# EasyEDA schematic Water_Counter_Nathan_Amir.json
TITLE: Counter_Water; REV: 1.0; Date: 2025-07-06; Sheet: 1/1; Company: Museum of Science
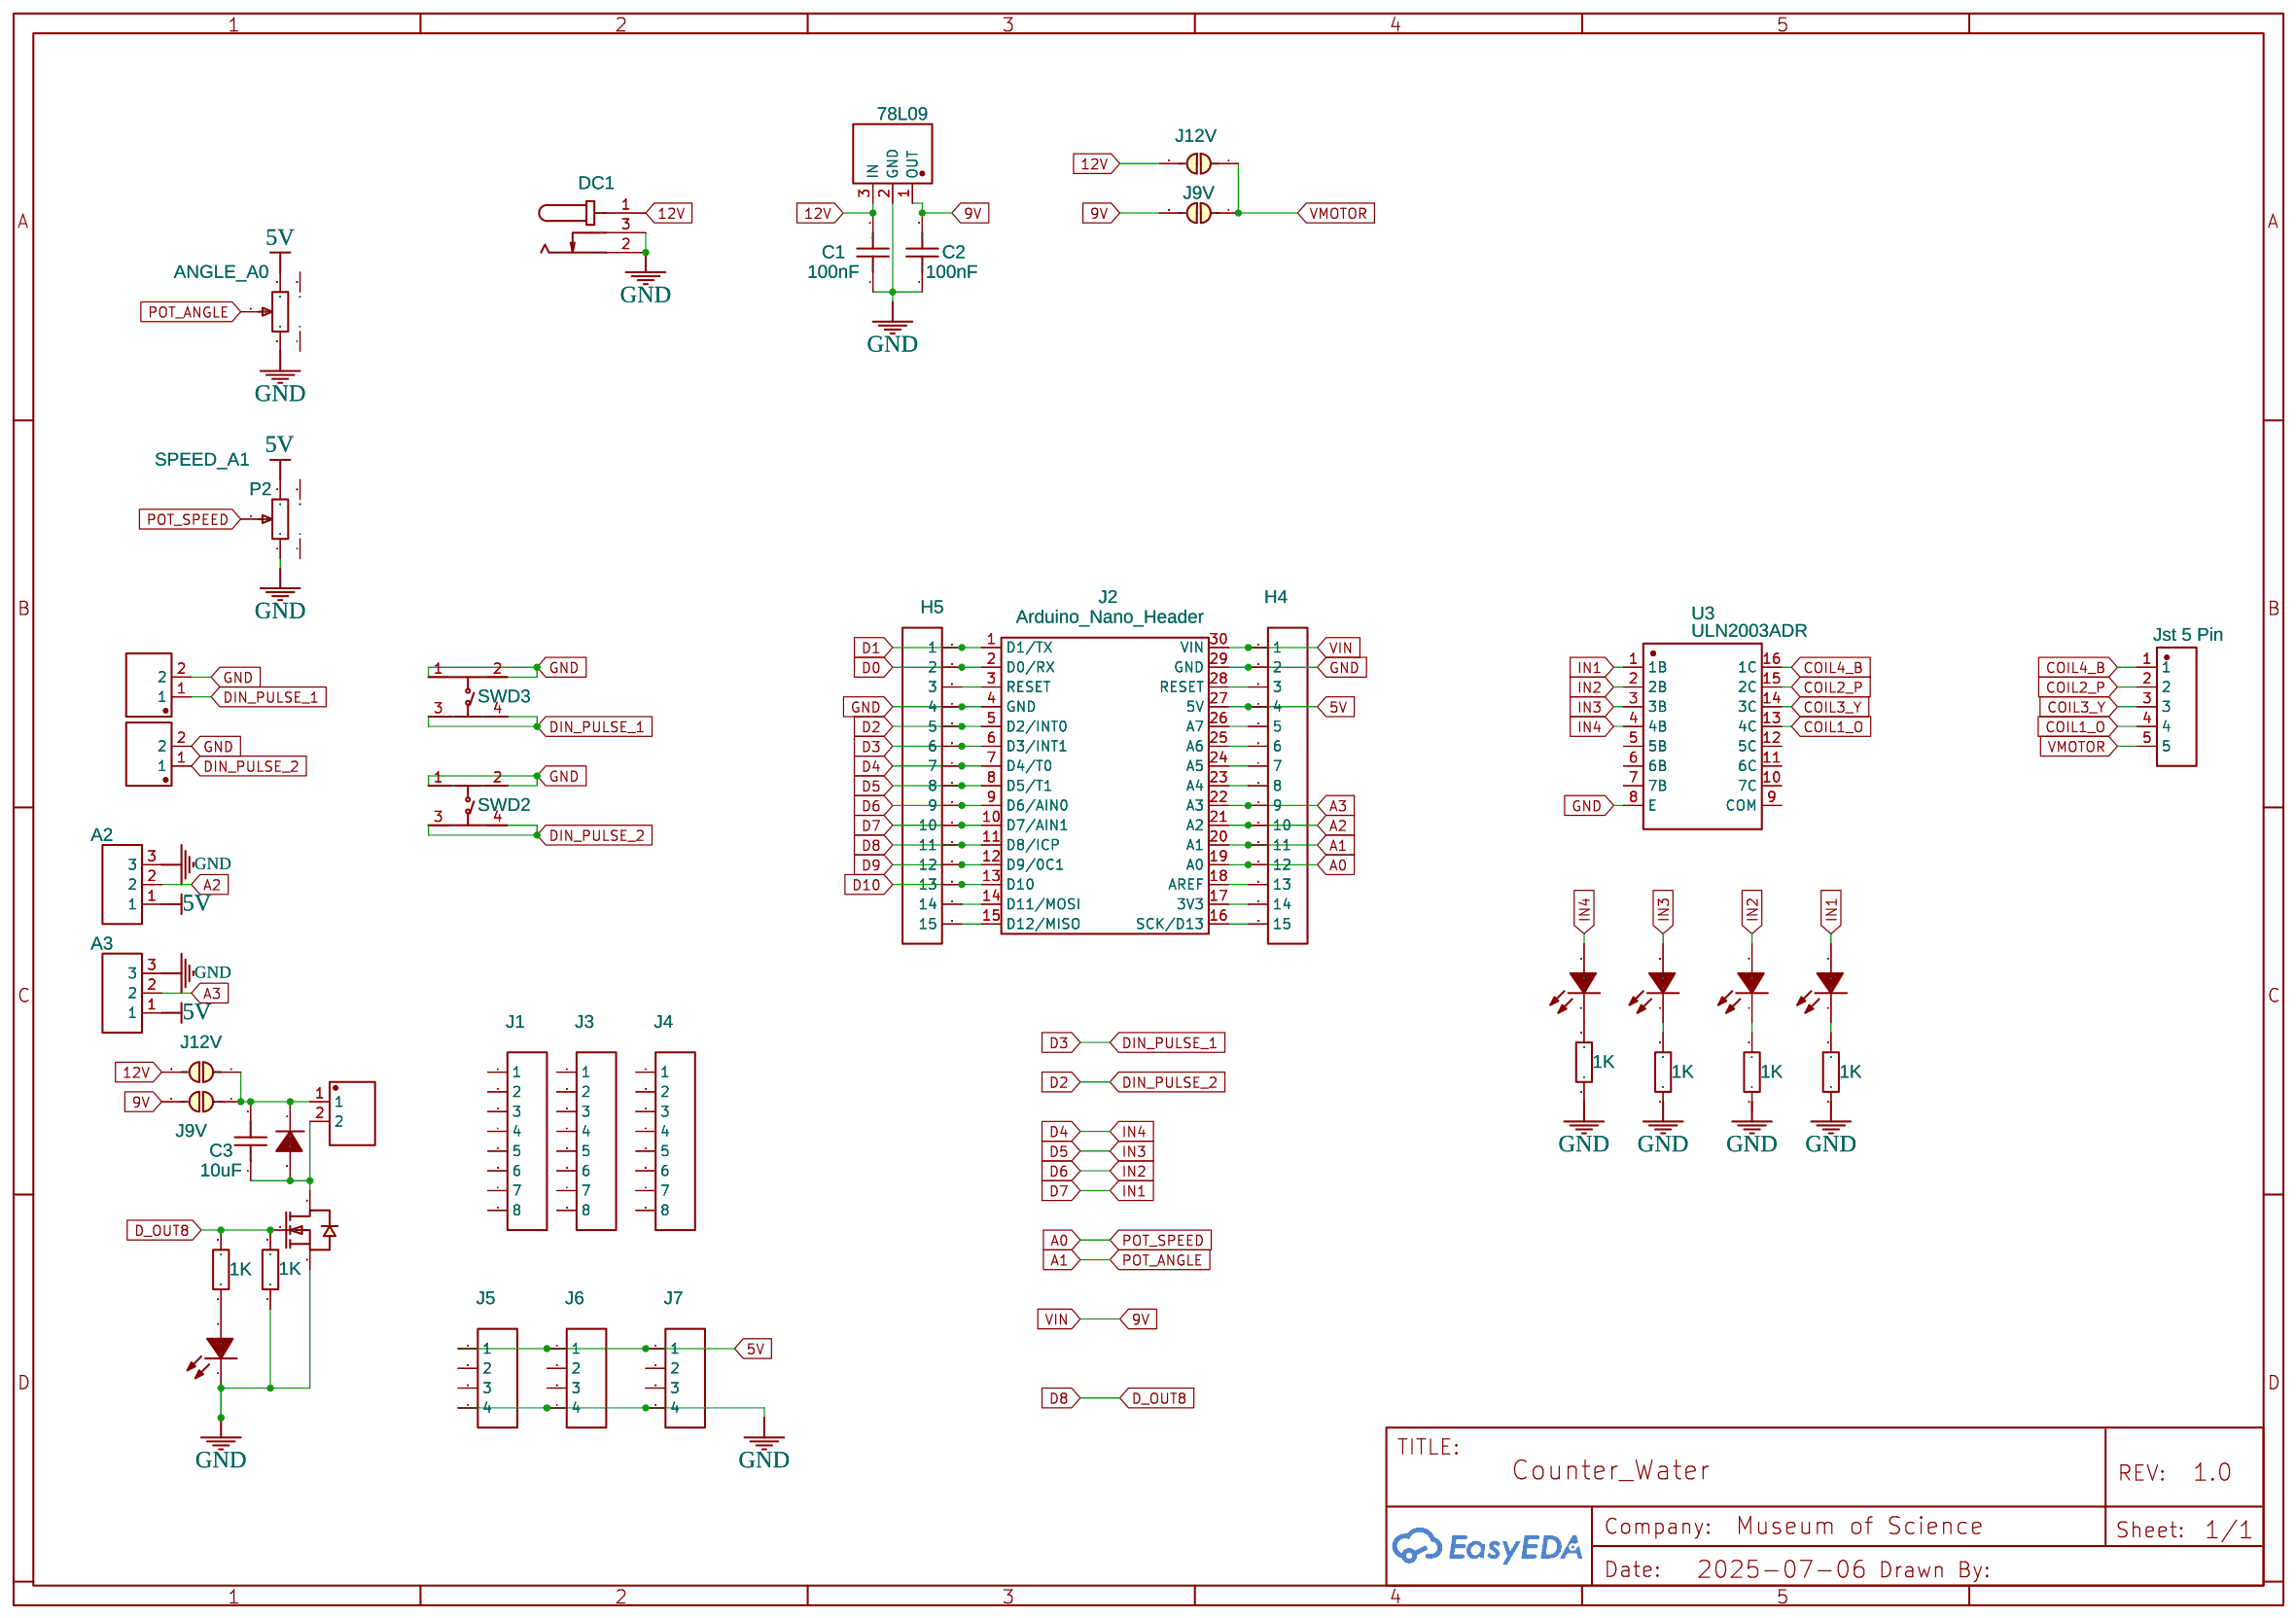
[diagram p0: schematic sheet]

## Parts
A2  FK2510  [CONN-TH_3P-P2.00_KF2510_3A]
A3  FK2510  [CONN-TH_3P-P2.00_KF2510_3A]
C1  100nF  [C0603]
C2  100nF  [C0603]
C3  10uF  [C0805]
D2  KF2510-2A  [CONN-TH_KF2510-2A]
D3  KF2510-2A  [CONN-TH_KF2510-2A]
DC1  DC  [DC-IN-TH_DC005]
ECON1  D_OUT8  [CONN-TH_KF2510-2A]
EDM1  1N4007  [SMAF_L3.5-W2.6-LS4.7-RD]
EQ1  Q  [SOT-23-3_L2.9-W1.3-P0.95-LS2.4-BR]
ERG1  1K  [R0603]
ERL1  1K  [R0603]
ERL2  1K  [R0603]
ERL3  1K  [R0603]
ERL4  1K  [R0603]
ERL5  1K  [R0603]
H4  HDR-F-2.54_1x15  [HDR-F-2.54_1X15]
H5  HDR-F-2.54_1x15  [HDR-F-2.54_1X15]
J1  HDR-M-2.54_1x8  [HDR-M-2.54_1X8]
J2  Arduino_Nano_Header  [DIP-30_L43.18-W15.24-ARDUINONANO]
J3  HDR-M-2.54_1x8  [HDR-M-2.54_1X8]
J4  HDR-M-2.54_1x8  [HDR-M-2.54_1X8]
J5  HDR-M-2.54_1x4  [HDR-M-2.54_1X4]
J5V_2  J9V  [JUMPERS_SMT-JUMPER_2_NC_PASTE_NO-SILK]
J6  HDR-M-2.54_1x4  [HDR-M-2.54_1X4]
J7  HDR-M-2.54_1x4  [HDR-M-2.54_1X4]
J9V_1  J9V  [JUMPERS_SMT-JUMPER_2_NC_PASTE_NO-SILK]
J12V_1  J12V  [JUMPERS_SMT-JUMPER_2_NC_PASTE_NO-SILK]
J12V_2  J12V  [JUMPERS_SMT-JUMPER_2_NC_PASTE_NO-SILK]
LED1  KT-0603R  [LED0603-RD]
LED2  KT-0603R  [LED0603-RD]
LED3  KT-0603R  [LED0603-RD]
LED4  KT-0603R  [LED0603-RD]
LED5  KT-0603R  [LED0603-RD]
P2  SPEED_A1  [RES-ADJ-TH_RV09]
P3  ANGLE_A0  [RES-ADJ-TH_RV09]
SWD2  TC-6610-7-160G  [SW-TH_4P-L5.0-W5.0-P4.50-LS6.5]
SWD3  TC-6610-7-160G  [SW-TH_4P-L5.0-W5.0-P4.50-LS6.5]
U1  78L09  [SOT-89-3_L4.5-W2.5-P1.50-LS4.0-BR]
U2  Jst 5 Pin  [JST 5 PIN]
U3  ULN2003ADR  [SOIC-16_L9.9-W3.9-P1.27-LS6.0-BL]

## Library data of the parts
A2 A3 = kf2510_3A: JLCPCB Part Class: Extended Part; Package Display: No
C1 C2 = CC0603KRX7R9BB104: Supplier: LCSC; Manufacturer: YAGEO(国巨); Supplier Part: C14663; JLCPCB Part Class: Basic Part
C3 = GRM21BR61H106KE43L: Contributor: LCSC; Supplier: LCSC; Supplier Part: C440198; Manufacturer: muRata(村田); JLCPCB Part Class: Basic Part
D2 D3 ECON1 = KF2510-2A: Supplier: LCSC; Manufacturer: BOOMELE; Supplier Part: C27543; JLCPCB Part Class: Extended Part; Package Display: No
DC1 = DC005-2.0MM: Supplier: LCSC; Manufacturer: SOFNG; Supplier Part: C111567; Package Display: No
EDM1 = 1N4007F: Supplier: LCSC; Manufacturer: SK; Supplier Part: C110856; JLCPCB Part Class: Extended Part; Package Display: No
EQ1 = JSM2302: Supplier: LCSC; Supplier Part: C5224189; Manufacturer: ElecSuper(静芯微）; Manufacturer Part: AO3400; Contributor: LCSC; JLCPCB Part Class: Extended Part; Package Display: No
ERG1 ERL1-ERL5 = 0603WAF1001T5E: Supplier: LCSC; Manufacturer: UniOhm; Supplier Part: C21190; JLCPCB Part Class: Basic Part; Package Display: No
H4 H5 = HDR-F-2.54_1x15: Supplier Part: C124408; Supplier: LCSC; Contributor: LCEDA_Lib; Package Display: No
J1 J3 J4 = HDR-M-2.54_1x8: Supplier Part: C190820; Supplier: LCSC; Contributor: LCEDA_Lib; Package Display: No
J2 = Arduino_Nano_Header
J5-J7 = HDR-M-2.54_1x4: Supplier Part: C124378; Supplier: LCSC; Contributor: LCEDA_Lib; Package Display: No
J5V_2 J9V_1 J12V_1 J12V_2 = JUMPER-SMT_2: Contributor: P-Thomsen; Package Display: No
LED1-LED5 = KT-0603R: Supplier: LCSC; Manufacturer: KENTO; Supplier Part: C2286; JLCPCB Part Class: Basic Part
P2 P3 = 长柄旋转电位器: Supplier: LCSC; Supplier Part: C2874842; Manufacturer: null; JLCPCB Part Class: Extended Part; Contributor: LCSC; Package Display: No
SWD2 SWD3 = TC-6610-7-160G: Contributor: LCSC; Supplier: LCSC; Supplier Part: C2845252; Manufacturer: HCTL(华灿天禄); JLCPCB Part Class: Extended Part; Package Display: No
U1 = 78L09U 78L09: Contributor: LCSC; Supplier: LCSC; Supplier Part: C2875177; Manufacturer: CBI(创基); JLCPCB Part Class: Extended Part; Package Display: No
U2 = Jst 5 Pin: Manufacturer: Vicky; Supplier: Vicky; Contributor: waqasalivicky123
U3 = ULN2003ADR: Supplier: LCSC; Manufacturer: TI(德州仪器); Supplier Part: C7512; JLCPCB Part Class: Basic Part

## Nets
5V: A2.1 A3.1 H4.4 J2.27(5V) J5.1 J6.1 J7.1 P2.3 P3.3
9V: C2.2 H4.1 J2.30(VIN) J5V_2.2 J9V_1.2 U1.1(OUT)
12V: C1.2 DC1.1 J12V_1.2 J12V_2.2 U1.3(IN)
GND: A2.3 A3.3 C1.1 C2.1 D2.2 D3.2 DC1.2 DC1.3 EQ1.2(S) ERG1.1 ERL1.1 ERL2.1 ERL3.1 ERL4.1 H4.2 H5.4 J2.4(GND) J2.29(GND) J5.4 J6.4 J7.4 LED1.1(K) P2.1 P3.1 SWD2.1 SWD2.2 SWD3.1 SWD3.2 U1.2(GND) U3.8(E)
A0: H4.12 J2.19(A0) P2.2
A1: H4.11 J2.20(A1) P3.2
A2: A2.2 H4.10 J2.21(A2)
A3: A3.2 H4.9 J2.22(A3)
COIL1_O: U2.4 U3.13(4C)
COIL2_P: U2.2 U3.15(2C)
COIL3_Y: U2.3 U3.14(3C)
COIL4_B: U2.1 U3.16(1C)
D0: H5.2 J2.2(D0/RX)
D1: H5.1 J2.1(D1/TX)
D2: D2.1 H5.5 J2.5(D2/INT0) SWD2.3 SWD2.4
D3: D3.1 H5.6 J2.6(D3/INT1) SWD3.3 SWD3.4
D4: H5.7 J2.7(D4/T0) LED5.2(A) U3.4(4B)
D5: H5.8 J2.8(D5/T1) LED4.2(A) U3.3(3B)
D6: H5.9 J2.9(D6/AIN0) LED3.2(A) U3.2(2B)
D7: H5.10 J2.10(D7/AIN1) LED2.2(A) U3.1(1B)
D8: EQ1.1(G) ERG1.2 ERL5.2 H5.11 J2.11(D8/ICP)
D9: H5.12 J2.12(D9/0C1)
D10: H5.13 J2.13(D10)
VMOTOR: J9V_1.1 J12V_1.1 U2.5
Net-(C3-1): C3.1 ECON1.2 EDM1.2(A) EQ1.3(D)
Net-(C3-2): C3.2 ECON1.1 EDM1.1(C) J5V_2.1 J12V_2.1
Net-(ERL1-2): ERL1.2 LED5.1(K)
Net-(ERL2-2): ERL2.2 LED3.1(K)
Net-(ERL3-2): ERL3.2 LED2.1(K)
Net-(ERL4-2): ERL4.2 LED4.1(K)
Net-(ERL5-1): ERL5.1 LED1.2(A)
Net-(H4-3): H4.3 J2.28(RESET)
Net-(H4-5): H4.5 J2.26(A7)
Net-(H4-6): H4.6 J2.25(A6)
Net-(H4-7): H4.7 J2.24(A5)
Net-(H4-8): H4.8 J2.23(A4)
Net-(H4-13): H4.13 J2.18(AREF)
Net-(H4-14): H4.14 J2.17(3V3)
Net-(H4-15): H4.15 J2.16(SCK/D13)
Net-(H5-3): H5.3 J2.3(RESET)
Net-(H5-14): H5.14 J2.14(D11/MOSI)
Net-(H5-15): H5.15 J2.15(D12/MISO)

Not connected (* = marked no-connect by the designer): J1 1 2 3 4 5 6 7 8; J3 1 2 3 4 5 6 7 8; J4 1 2 3 4 5 6 7 8; J5 2 3; J6 2 3; J7 2 3; P2 4 5; P3 4 5; U3 5(5B) 6(6B) 7(7B) 9(COM) 10(7C) 11(6C) 12(5C)
